# Altium schematic sheet 05_H3USB.SchDoc
size A3
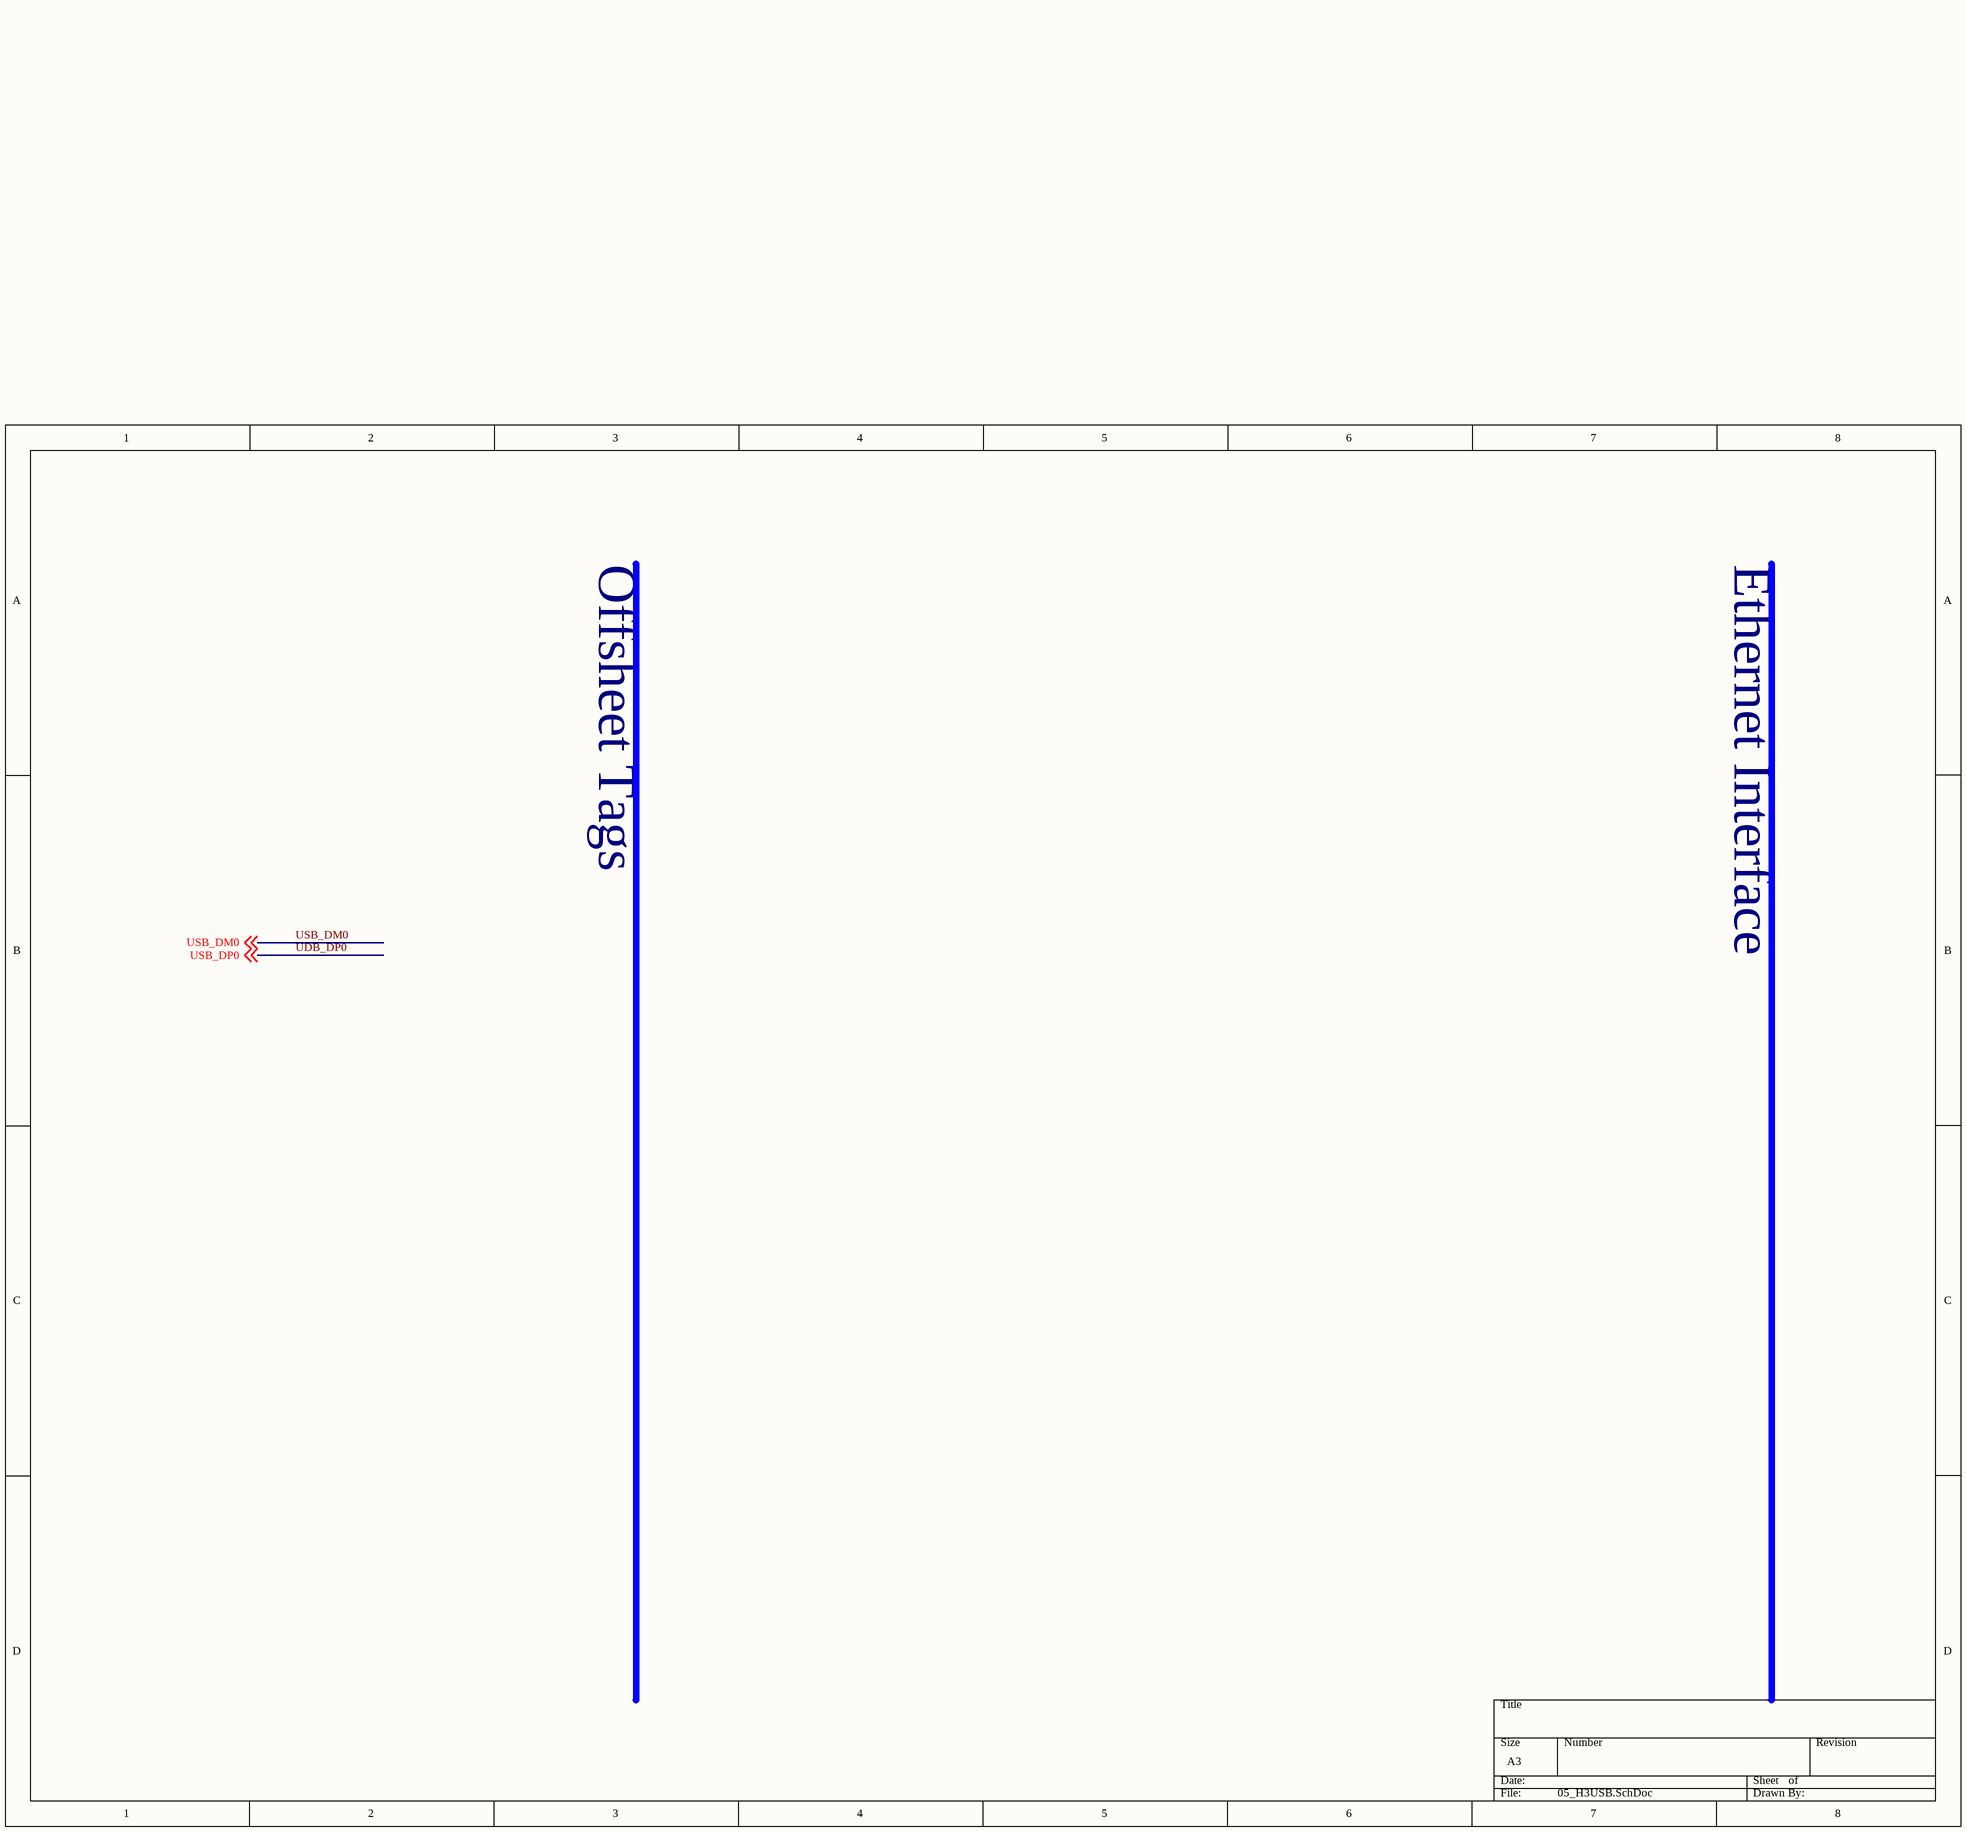
[diagram p0: 05_H3USB.SchDoc]

## Notes on the sheet
- Offsheet Tags
- Ethernet Interface